# Altium schematic sheet Smart_PillBox_RF03.SchDoc
size A4
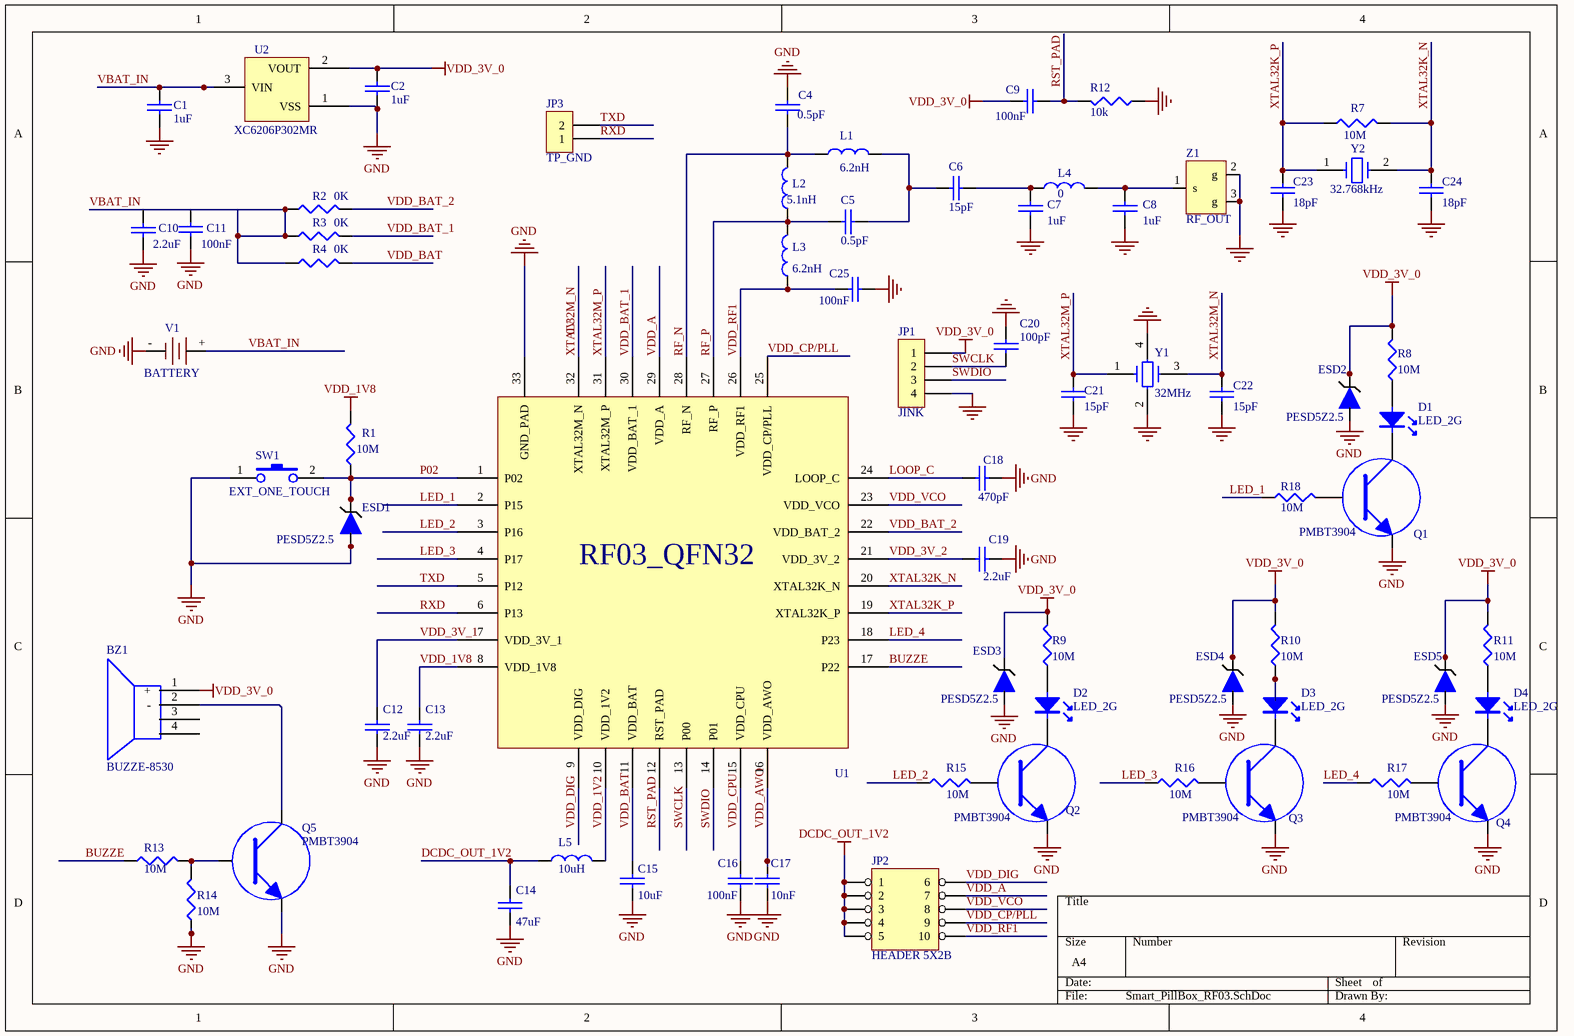
[diagram p0: Smart_PillBox_RF03.SchDoc]

## Parts
BZ1  BUZZE-8530  [BZ_8530]
C1  1uF  [0402]
C2  1uF
C4  0.5pF
C5  0.5pF
C6  15pF
C7  1uF
C8  1uF
C9  100nF
C10  2.2uF
C11  100nF
C12  2.2uF
C13  2.2uF
C14  47uF
C15  10uF
C16  100nF
C17  10nF
C18  470pF
C19  2.2uF
C20  100pF
C21  15pF
C22  15pF
C23  18pF
C24  18pF
C25  100nF
D1  LED_2G  [1005]
D2  LED_2G  [1005]
D3  LED_2G  [1005]
D4  LED_2G  [1005]
ESD1  PESD5Z2.5
ESD2  PESD5Z2.5
ESD3  PESD5Z2.5
ESD4  PESD5Z2.5
ESD5  PESD5Z2.5
JP1  JINK  [HDR4_2.54]
JP2  HEADER 5X2B  [HDR5X2B]
JP3  TP_GND  [HDR2_2.54]
L1  6.2nH
L2  5.1nH
L3  6.2nH
L4  0  [0402]
L5  10uH
Q1  PMBT3904
Q2  PMBT3904
Q3  PMBT3904
Q4  PMBT3904
Q5  PMBT3904
R1  10M
R2  0K
R3  0K
R4  0K
R7  10M  [0402]
R8  10M
R9  10M
R10  10M
R11  10M
R12  10k  [0402]
R13  10M
R14  10M
R15  10M
R16  10M
R17  10M
R18  10M
SW1  EXT_ONE_TOUCH  [SW4P-SMD4P]
U1  RF03_QFN32  [QFN32_4X4]
U2  XC6206P302MR
V1  BATTERY
Y1  32MHz  [CX-101F]
Y2  32.768kHz  [bx-nx2012-32.768kHz]
Z1  RF_OUT  [SMA-E]

## Nets
DCDC_OUT_1V2: C14.2 JP2.1 JP2.2 JP2.3 JP2.4 JP2.5 L5.1
GND: C1.2 C2.2 C4.1 C7.1 C8.1 C10.1 C11.1 C12.2 C13.1 C14.1 C15.2 C16.1 C17.2 C18.2 C19.2 C20.2 C21.2 C22.2 C23.2 C24.2 C25.1 ESD1.2 JP1.4 Q1.3 Q2.3 Q3.3 Q4.3 Q5.3 R12.1 R14.1 SW1.1 U1.33(GND_PAD) U2.1(VSS) V1.- Y1.2 Y1.4 Z1.2(g) Z1.3(g)
VDD_1V8: C13.2 R1.2 U1.8(VDD_1V8)
VDD_3V_0: BZ1.1(+) C2.1 C9.2 ESD2.1 ESD3.1 ESD4.1 ESD5.1 JP1.1 R8.2 R9.2 R10.2 R11.2 U2.2(VOUT)
0V: C22.1 U1.32(XTAL32M_N) Y1.3  [also labelled XTAL32M_N]
BUZZE: R13.1 U1.17(P22)
LED_1: R18.1 U1.2(P15)
LED_2: R15.1 U1.3(P16)
LED_3: R16.1 U1.4(P17)
LED_4: R17.1 U1.18(P23)
LOOP_C: C18.1 U1.24(LOOP_C)
P02: ESD1.1 R1.1 SW1.2 U1.1(P02)
RF_N: C4.2 L1.1 L2.2 U1.28(RF_N)
RF_P: C5.1 L2.1 L3.2 U1.27(RF_P)
RST_PAD: C9.1 R12.2 U1.12(RST_PAD)
RXD: JP3.1 U1.6(P13)
SWCLK: C20.1 JP1.2 U1.13(P00)
SWDIO: JP1.3 U1.14(P01)
TXD: JP3.2 U1.5(P12)
VBAT_IN: C1.1 C10.2 C11.2 R2.1 R3.1 R4.1 U2.3(VIN) V1.+
VDD_1V2: L5.2 U1.10(VDD_1V2)
VDD_3V_1: C12.1 U1.7(VDD_3V_1)
VDD_3V_2: C19.1 U1.21(VDD_3V_2)
VDD_A: JP2.7 U1.29(VDD_A)
VDD_AWO: C17.1 U1.16(VDD_AWO)
VDD_BAT: C15.1 R4.2 U1.11(VDD_BAT)
VDD_BAT_1: R3.2 U1.30(VDD_BAT_1)
VDD_BAT_2: R2.2 U1.22(VDD_BAT_2)
VDD_CP/PLL: JP2.9 U1.25(VDD_CP/PLL)
VDD_CPU: C16.2 U1.15(VDD_CPU)
VDD_DIG: JP2.6 U1.9(VDD_DIG)
VDD_RF1: C25.2 JP2.10 L3.1 U1.26(VDD_RF1)
VDD_VCO: JP2.8 U1.23(VDD_VCO)
XTAL32K_N: C24.1 R7.2 U1.20(XTAL32K_N) Y2.2
XTAL32K_P: C23.1 R7.1 U1.19(XTAL32K_P) Y2.1
XTAL32M_P: C21.1 U1.31(XTAL32M_P) Y1.1
NetBZ1_2: BZ1.2(-) Q5.1
NetC5_2: C5.2 C6.1 L1.2
NetC6_2: C6.2 C7.2 L4.1
NetC8_2: C8.2 L4.2 Z1.1(s)
NetD1_1: D1.1(A) R8.1
NetD1_2: D1.2(K) Q1.1
NetD2_1: D2.1(A) R9.1
NetD2_2: D2.2(K) Q2.1
NetD3_1: D3.1(A) R10.1
NetD3_2: D3.2(K) Q3.1
NetD4_1: D4.1(A) R11.1
NetD4_2: D4.2(K) Q4.1
NetQ1_2: Q1.2 R18.2
NetQ2_2: Q2.2 R15.2
NetQ3_2: Q3.2 R16.2
NetQ4_2: Q4.2 R17.2
NetQ5_2: Q5.2 R13.2 R14.2

Not connected (* = marked no-connect by the designer): BZ1 3 4; ESD2 2; ESD3 2; ESD4 2; ESD5 2

## Notes on the sheet
- Labels drawn without touching a wire or pin: GND

## Library data of the parts
C1 C2 C7 C8 = C-SM-0402-1uF: Chip C
C4 C5 = C-SM-0603-0.5pF: Chip C
C6 C21 C22 = C-SM-0402-15pF: Chip C
C9 C11 C16 C25 = C-SM-0402-100nF: Chip C
C10 C12 C13 C19 = C-SM-0402-2.2uF: Chip C
C14 = C-SM-0603-47uF: Chip C
C15 = C-SM-0402-10uF: Chip C
C17 = C-SM-0402-10nF: Chip C
C18 = C-SM-0402-470pF: Chip C
C20 = C-SM-0402-100pF: Chip C
C23 C24 = C-SM-0402-18pF: Chip C
D1-D4 = LED
ESD1-ESD5 = ESD/SM/SOD-523: PESD5Z2.5,115
JP1 = CON/4P 2.54: Hole 40mil
JP2 = HEADER 5X2B: Pitch 2.54mm
JP3 = CON/2P 2.54: Hole 40mil
L1 L3 = L/SM/0402/6.2nH: MLG1005S6N2ST000
L2 = L/SM/0402/5.1nH: LQG15HS5N1S02D
L4 = L/0402: Chip L
L5 = L/SM/0603/10uH: MCL1608S100MT
Q1-Q5 = TRAN/SM/SOT23-3: NPN Switching transistor
R1 R8-R11 R13-R18 = R-SM-0402-10M: Chip R
R2-R4 = R-SM-0402-0K: Chip R
R7 R12 = R/0402: Chip R
SW1 = SW-PB_1
U2 = LDO/SOT-23/XC6206P302MR: Chip LDO XC6206P302MR
V1 = BATTERY/CR2032: Battery CR2032
Y1 = CRYSTAL/32MHz/3.2*2.5
Y2 = CRYSTAL/32.768kHz/NX2012
Z1 = SMA-E
BZ1 = BUZZE-8530: value: BUZZE-8530